# Altium schematic sheet Revision History.SchDoc: Revision History
size A4; DocumentNumber: 2; SheetNumber: 2; SheetTotal: 3
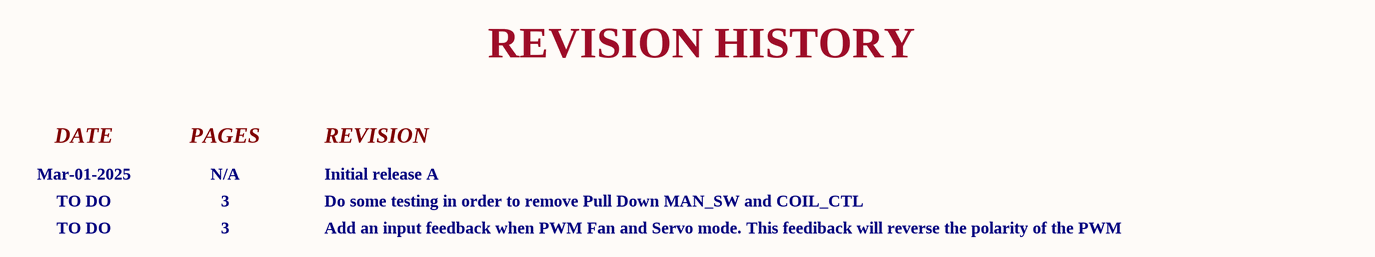
[diagram p0: Revision History.SchDoc]

## Notes on the sheet
- REVISION HISTORY
- Mar-01-2025
- DATE
- N/A
- PAGES
- Initial release A
- REVISION
- TO DO
- 3
- Do some testing in order to remove Pull Down MAN_SW and COIL_CTL
- Add an input feedback when PWM Fan and Servo mode. This feediback will reverse the polarity of the PWM
- Title:
- Project:
- Revision:
- Sheet
- of
- Date:
- Author: